# Altium schematic sheet Preamplifier_1.SchDoc
size A4
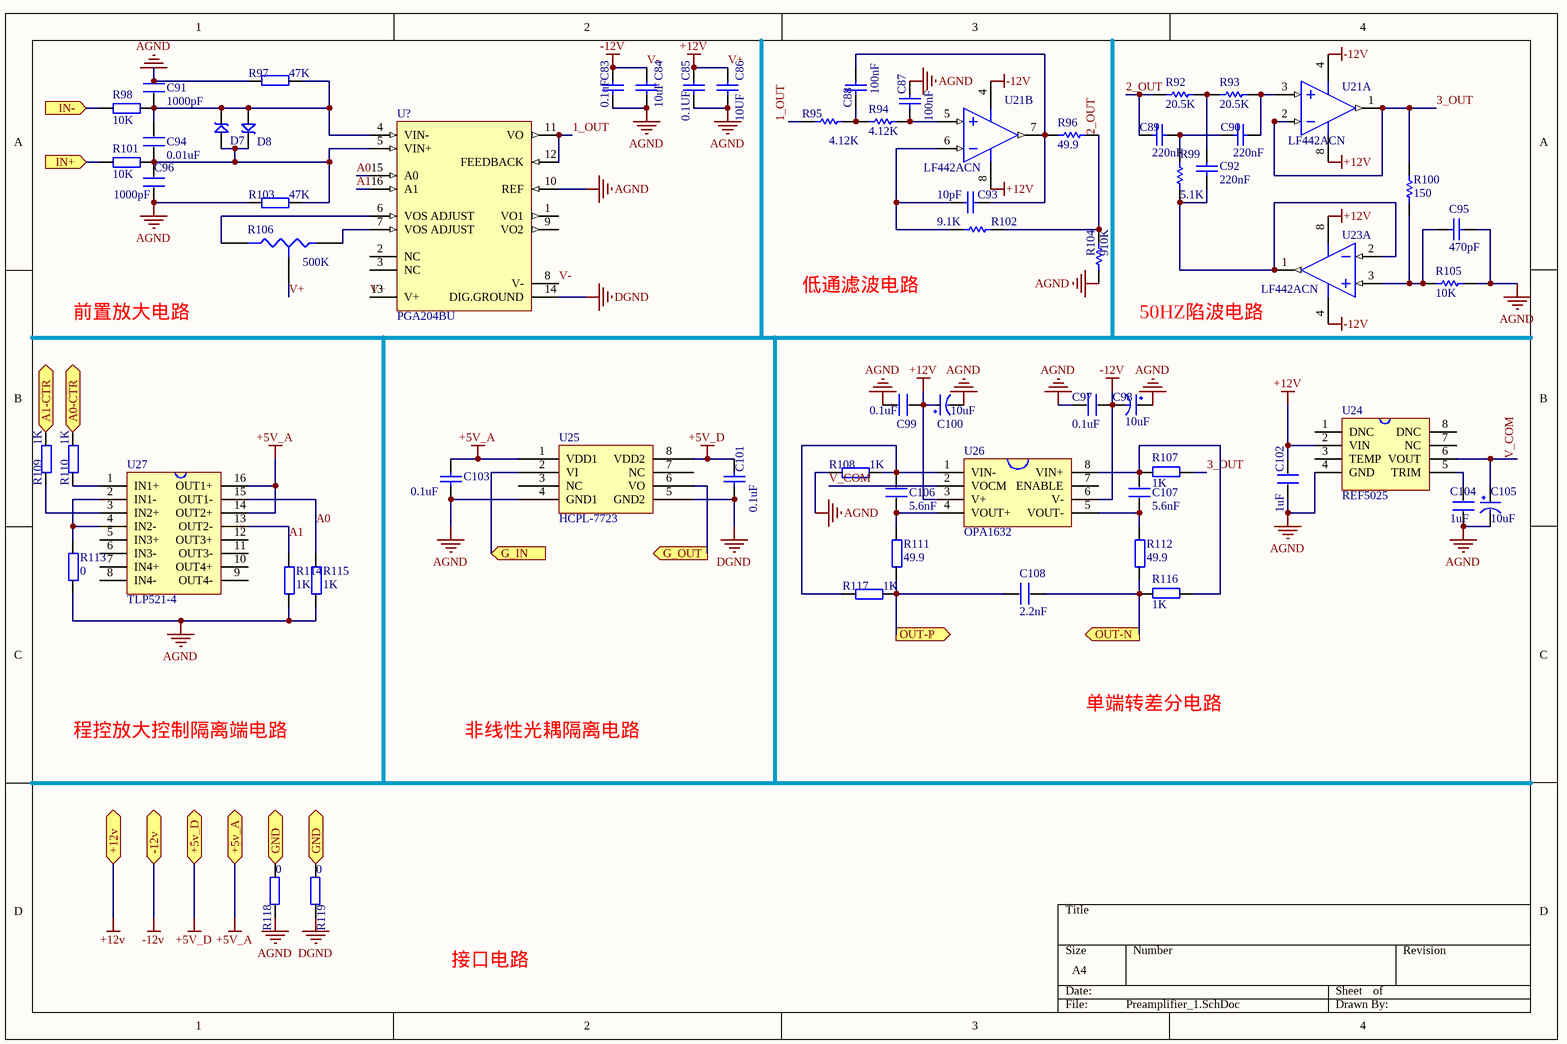
[diagram p0: Preamplifier_1.SchDoc]

## Parts
C83  0.1uF  [0805]
C84  10uF  [0805]
C85  0.1UF  [0805]
C86  10UF  [0805]
C87  100nF  [C0805]
C88  100nF  [C0805]
C89  220nF  [C0805]
C90  220nF  [C0805]
C91  1000pF  [0603P]
C92  220nF  [C0805]
C93  10pF  [C0805]
C94  0.01uF  [0603P]
C95  470pF  [C0805]
C96  1000pF  [0603P]
C97  0.1uF  [0603P]
C98  10uF  [CC6.56.5]
C99  0.1uF  [0603P]
C100  10uF  [CC6.56.5]
C101  value 0.1uF  [RAD-0.3]  (hidden comment: Cap)
C102  1uF  [0603P]
C103  value 0.1uF  [RAD-0.3]  (hidden comment: Cap)
C104  1uF  [0603P]
C105  10uF  [CC6.56.5]
C106  5.6nF  [0603P]
C107  5.6nF  [0603P]
C108  2.2nF  [0603P]
D7  SMBJ5.0A  [SMBJ]  (value not drawn)
D8  SMBJ5.0A  [SMBJ]  (value not drawn)
R92  20.5K  [R0805]
R93  20.5K  [R0805]
R94  4.12K  [R0805]
R95  4.12K  [R0805]
R96  49.9  [R0805]
R97  47K  [0603P]
R98  10K  [0603P]
R99  5.1K  [R0805]
R100  150  [R0805]
R101  10K  [0603P]
R102  9.1K  [R0805]
R103  47K  [0603P]
R104  910K  [R0805]
R105  10K  [R0805]
R106  value 500K  [VR3]  (hidden comment: Res Tap)
R107  1K  [0603P]
R108  1K  [0603P]
R109  1K  [0603P]
R110  1K  [0603P]
R111  49.9  [0603P]
R112  49.9  [0603P]
R113  0  [0603P]
R114  1K  [0603P]
R115  1K  [0603P]
R116  1K  [0603P]
R117  1K  [0603P]
R118  0  [0603P]
R119  0  [0603P]
U21  LF442ACN  [N08E]  (parts A,B of 2)
U23  LF442ACN  [N08E]  (part A of 2)
U24  REF5025  [R-PDSO-G8]
U25  HCPL-7723
U26  OPA1632  [S-PDSO-G8]
U27  TLP521-4  [11-20A3]
U?  PGA204BU  [TI-DW16_L]

## Ports
+5v_A, +5v_D, +12v, -12v, A0-CTR (in), A1-CTR (in), G_IN (in), G_OUT (out), GND, IN+ (in), IN- (in), OUT-N (out), OUT-P (out)

## Nets
+5V_A: C103.2 U25.1(VDD1) U27.14(OUT2+) U27.16(OUT1+) ; port +5v_A
+5V_D: C101.2 U25.8(VDD2) ; port +5v_D
AGND: C83.1 C84.1 C85.1 C86.1 C87.1 C91.2 C95.1 C96.1 C97.1 C98.1(VCC) C99.1 C100.2(GND) C102.1 C103.1 C104.1 C105.2(GND) R97.2 R103.1 R104.1 R105.1 R108.1 R113.1 R114.1 R115.1 R118.2 U24.4(GND) U25.4(GND1) U?.10(REF)
DGND: C101.1 R119.2 U25.5(GND2) U?.14(DIG.GROUND)
V+: C85.2 C86.2 C99.2 C100.1(VCC) C102.2 R106.3(TAP) U21.8(V+) U23.8(V+) U24.2(VIN) U26.3(V+) U?.13(V+) ; port +12v  [also labelled +12V]
V-: C83.2 C84.2 C97.2 C98.2(GND) U21.4(V-) U23.4(V-) U26.6(V-) U?.8(V-) ; port -12v  [also labelled -12V]
1_OUT: R95.1 U?.11(VO) U?.12(FEEDBACK)
2_OUT: C89.1 R92.1 R96.2 R102.2 R104.2
3_OUT: R100.2 R107.1 U21.1(OUTA) U21.2(INA-)
A0: R115.2 U27.15(OUT1-) U?.15(A0)
A0-CTR: R110.2 ; port A0-CTR
A1: R114.2 U27.13(OUT2-) U?.16(A1)
A1-CTR: R109.2 ; port A1-CTR
G_IN: U25.2(VI) ; port G_IN
G_OUT: U25.6(VO) ; port G_OUT
GND: R118.1 R119.1 ; port GND
IN+: R101.1 ; port IN+
IN-: R98.1 ; port IN-
OUT-N: C108.2 R112.1 R116.2 ; port OUT-N
OUT-P: C108.1 R111.1 R117.2 ; port OUT-P
V_COM: C105.1(VCC) U24.6(VOUT) U26.2(VOCM)
NetC87_2: C87.2 R94.2 U21.5(INB+)
NetC88_1: C88.1 R94.1 R95.2
NetC88_2: C88.2 C93.2 R96.1 U21.7(OUTB)
NetC89_2: C89.2 C90.1 R99.2
NetC90_2: C90.2 R93.2 U21.3(INA+)
NetC91_1: C91.1 C94.2 D7.2 D8.1 R97.1 R98.2 U?.4(VIN-)
NetC92_1: C92.1 R99.1 U23.1(OUTA) U23.2(INA-)
NetC92_2: C92.2 R92.2 R93.1
NetC93_1: C93.1 R102.1 U21.6(INB-)
NetC94_1: C94.1 C96.2 D7.1 D8.2 R101.2 R103.2 U?.5(VIN+)
NetC95_2: C95.2 R100.1 R105.2 U23.3(INA+)
NetC104_2: C104.2 U24.5(TRIM)
NetC106_1: C106.1 R111.2 U26.4(VOUT+)
NetC106_2: C106.2 R108.2 R117.1 U26.1(VIN-)
NetC107_1: C107.1 R112.2 U26.5(VOUT-)
NetC107_2: C107.2 R107.2 R116.1 U26.8(VIN+)
NetR106_1: R106.1(A) U?.7(VOS_ADJUST)
NetR106_2: R106.2(B) U?.6(VOS_ADJUST)
NetR109_1: R109.1 U27.3(IN2+)
NetR110_1: R110.1 U27.1(IN1+)
NetR113_2: R113.2 U27.2(IN1-) U27.4(IN2-)

Not connected (* = marked no-connect by the designer): U24 1(DNC) 3(TEMP) 7(NC) 8(DNC); U25 3(NC) 7(NC); U26 7(ENABLE); U27 5(IN3+) 6(IN3-) 7(IN4+) 8(IN4-) 9(OUT4-) 10(OUT4+) 11(OUT3-) 12(OUT3+); U? 1(VO1) 2(NC) 3(NC) 9(VO2)

## Notes on the sheet
- 前置放大电路
- 低通滤波电路
- 50HZ陷波电路
- 单端转差分电路
- 程控放大控制隔离端电路
- 非线性光耦隔离电路
- 接口电路

## Library data of the parts
C83-C90 C92 C93 C95 C101 C103 = Cap: Capacitor; Published: 8-Jun-2000; LatestRevisionDate: 17-Jul-2002; LatestRevisionNote: Re-released for DXP Platform.; PackageReference: RAD-0.3; Publisher: Altium Limited; PackageDescription: Radial Cap, Thru-Hole; 2 Leads; 0.3 in Pin Spacing
  C83 C85: Value: 0.1UF
  C84 C86: Value: 10UF
  C87 C88: Value: 100nF
  C89 C90 C92: Value: 220nF
  C93: Value: 10pF
  C95: Value: 470pF
C91 C94 C96 C97 C99 C102 C104 C106-C108 = C
C98 C100 C105 = CAP
D7 D8 = SMBJ: TVS
R92-R96 R99 R100 R102 R104 R105 = Res1: Resistor; Published: 8-Jun-2000; LatestRevisionDate: 17-Jul-2002; LatestRevisionNote: Re-released for DXP Platform.; PackageReference: AXIAL-0.3; Publisher: Altium Limited; PackageDescription: Axial Device, Thru-Hole; 2 Leads; 0.3 in Pin Spacing
  R92 R93: Value: 20.5K
  R94 R95: Value: 4.12K
  R96: Value: 49.9
  R99: Value: 5.1K
  R100: Value: 150
  R102: Value: 9.1K
  R104: Value: 910K
  R105: Value: 10K
R97 R98 R101 R103 R107-R119 = R
R106 = Res Tap: Tapped Resistor; Sim Note: Enter the Resistance value and the set point into parameter fields.; Set Position: 0.5; Published: 24-Mar-1999; LatestRevisionDate: 17-Jul-2002; LatestRevisionNote: Re-released for DXP Platform.; PackageReference: VR3; Publisher: Altium Limited; PackageDescription: Variable Resistor, Thru-Hole; 3 Leads
U21 U23 = LF442ACN: Dual Low Power JFET Input Operational Amplifier, 8-pin MDIP; Manufacturer: National Semiconductor; PackageTopMarking: NSUZXYTTE#*LF*442ACN; PowerWise: N; CompType: Amplifiers; Published: 4-Dec-2008; LatestRevisionDate: 13-Jan-2009; LatestRevisionNote: Sim Model Added.; DatasheetVersion: Aug-2000; PackageVersion: revG, May-2006; PackageReference: N08E; Publisher: Altium Limited; PackageDescription: MDIP, .365 x .250 x .130in, 8 Lead, .100in Pitch; Supplier 1: Farnell; Supplier Part Number 1: 4465726; PartNumber: LF442ACN; RoHS: N; PinCount: 8; Code_JEDEC: MS-001-BA; ComponentLink1Description: LF442 Datasheet; ComponentLink1URL: http://www.national.com/ds/LF/LF442.pdf; ComponentLink2Description: LF442 Web Page; ComponentLink2URL: http://www.national.com/pf/LF/LF442.html; ComponentLink3Description: N08E Package Page; ComponentLink3URL: http://www.national.com/packaging/folders/n08e.html
U25 = HCPL
U27 = TLP521
U? = PGA204BU: Programmable Gain Instrumentation Amplifier, -40 to 85 degC, 16-pin SOIC (DW16), Green (RoHS & no Sb/Br); Manufacturer: Texas Instruments; Common Mode Input High(Min)(V): 10.5; Common Mode Input Low(Min)(V): -10.5; Gain Error (+/-)(Max)(%): 0.024; Gain(V/V): 1, 10, 100, 1000; Input Bias Current (+/-)(Max)(nA): 2; Input Offset (+/-)(Max)(uV): 50; Input Offset Drift (+/-)(Max)(uV/Degrees Celsius): 0.25; Noise at 1kHz(Typ)(nV/rt(Hz)): 13; Non-Linearity (+/-)(Max)(%): 0.001; Number of Channels: 1; Quiescent Current (+/-)(Typ)(mA): 5.2; Settling Time to 0.01%(Typ)(us): 140; Slew Rate(Typ)(V/us): 0.7; SubFamily: Programmable Gain Amplifier; Vs(Max)(V): 36; Vs(Min)(V): 9; DatasheetVersion: SBOS022; PackageVersion: 4040000-2/G, 01/2011; PackageReference: DW16; PackageDescription: 16-Pin Plastic Small Outline, Body 10.30 x 7.50 mm, Pitch 1.27 mm; Supplier 1: Digi-Key; Supplier Part Number 1: PGA204BU-ND; Supplier 2: Farnell; Supplier Part Number 2: 1207094; Supplier 3: Newark; Supplier Part Number 3: 24M5804; Supplier 4: Newark; Supplier Part Number 4: 35C1958; Supplier 5: Mouser; Supplier Part Number 5: 595-PGA204BU; Eco-Plan: Green (RoHS & no Sb/Br); Mounting Technology: Surface Mount; Code_JEDEC: MS-013; PartNumber: PGA204BU; ComponentLink1Description: Manufacturer URL; ComponentLink1URL: http://www.ti.com/; ComponentLink2Description: Datasheet; ComponentLink2URL: http://www.ti.com/general/docs/lit/getliterature.tsp?genericPartNumber=PGA204&fileType=pdf; ComponentLink3Description: Package Specification; ComponentLink3URL: http://www.ti.com/litv/pdf/msoi003g